# Altium project WalkMod C0.PrjPcb
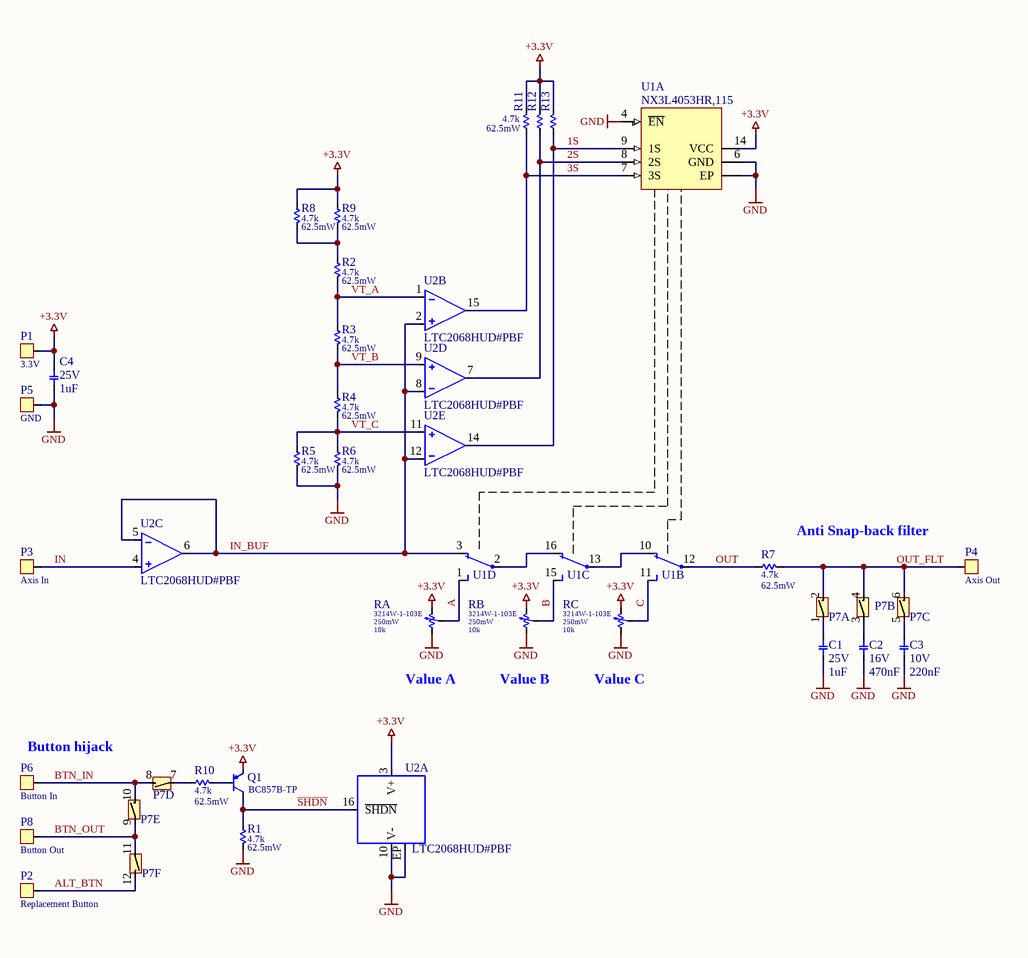
[diagram p0: WalkMod C0.SchDoc]
Author: TheComet; BoardRevision: C0; ProjectTitle: WalkMod
1 sheet, 31 parts. Net scope: global (net labels, ports and power ports of the same name join across sheets).
Board file: WalkMod C0.PcbDoc

## Sheet WalkMod C0.SchDoc: =ProjectTitle
size A4; DrawnBy: TheComet; Engineer: TheComet; Revision: C0; SheetNumber: 1; SheetTotal: 1

### Parts
C1  value 1uF  Value2: 25V  [CX7R0603K]  (hidden comment: CL10B105KA8NFNC)
C2  value 470nF  Value2: 16V  [CX7R0603K]  (hidden comment: CL10B474KO8NFNC)
C3  value 220nF  Value2: 10V  [CX7R0603K]  (hidden comment: CC0603KRX7R6BB224)
C4  value 1uF  Value2: 25V  [CX7R0603K]  (hidden comment: CL10B105KA8NFNC)
P1  Name: 3.3V  [PAD_2X1.5_SQUARE]  (hidden comment: SMD Pad 1 pin)
P2  Name: Replacement Button  [PAD_2X1.5_SQUARE]  (hidden comment: SMD Pad 1 pin)
P3  Name: Axis In  [PAD_2X1.5_SQUARE]  (hidden comment: SMD Pad 1 pin)
P4  Name: Axis Out  [PAD_2X1.5_SQUARE]  (hidden comment: SMD Pad 1 pin)
P5  Name: GND  [PAD_2X1.5_SQUARE]  (hidden comment: SMD Pad 1 pin)
P6  Name: Button In  [PAD_2X1.5_SQUARE]  (hidden comment: SMD Pad 1 pin)
P7  DS05-127-2-06BK-SMT-TR  [CUI-DS05-127-2-06BK-SMT_C]  (value not drawn)  (parts A,B,C,D,E,F of 6)
P8  Name: Button Out  [PAD_2X1.5_SQUARE]  (hidden comment: SMD Pad 1 pin)
Q1  BC857B-TP  [BC8xx_SOT23-3_C]
R1  value 4.7k  Value2: 62.5mW  [RT0402_C]  (hidden comment: RG1005P-472-B-T5)
R2  value 4.7k  Value2: 62.5mW  [RT0402_C]  (hidden comment: RG1005P-472-B-T5)
R3  value 4.7k  Value2: 62.5mW  [RT0402_C]  (hidden comment: RG1005P-472-B-T5)
R4  value 4.7k  Value2: 62.5mW  [RT0402_C]  (hidden comment: RG1005P-472-B-T5)
R5  value 4.7k  Value2: 62.5mW  [RT0402_C]  (hidden comment: RG1005P-472-B-T5)
R6  value 4.7k  Value2: 62.5mW  [RT0402_C]  (hidden comment: RG1005P-472-B-T5)
R7  value 4.7k  Value2: 62.5mW  [RT0402_C]  (hidden comment: RG1005P-472-B-T5)
R8  value 4.7k  Value2: 62.5mW  [RT0402_C]  (hidden comment: RG1005P-472-B-T5)
R9  value 4.7k  Value2: 62.5mW  [RT0402_C]  (hidden comment: RG1005P-472-B-T5)
R10  value 4.7k  Value2: 62.5mW  [RT0402_C]  (hidden comment: RG1005P-472-B-T5)
R11  value 4.7k  Value2: 62.5mW  [RT0402_C]  (hidden comment: RG1005P-472-B-T5)
R12  RG1005P-472-B-T5  [RT0402_C]  (value not drawn)
R13  RG1005P-472-B-T5  [RT0402_C]  (value not drawn)
RA  3214W-1-103E  value 10k  Value2: 250mW  [BOURNS_3214W_C]
RB  3214W-1-103E  value 10k  Value2: 250mW  [BOURNS_3214W_C]
RC  3214W-1-103E  value 10k  Value2: 250mW  [BOURNS_3214W_C]
U1  NX3L4053HR,115  [HXQFN16_SOT1039-2_C]  (parts A,B,C,D of 4)
U2  LTC2068HUD#PBF  [QFN16_0.5_C]  (parts A,B,C,D,E of 5)

### Nets
+3.3V: C4.2 P1.1 Q1.E R8.2 R9.2 R11.1 R12.1 R13.1 RA.3 RB.3 RC.3 U1.14(VCC) U2.3(V+)
GND: C1.1 C2.1 C3.1 C4.1 P5.1 R1.1 R5.1 R6.1 RA.1 RB.1 RC.1 U1.4(~{EN}) U1.6(GND) U1.EP U2.10(V-) U2.EP
1S: R13.2 U1.9(1S) U2.14(OUTD)
2S: R12.2 U1.8(2S) U2.7(OUTC)
3S: R11.2 U1.7(3S) U2.15(OUTA)
A: RA.2 U1.1(3Y1)
ALT_BTN: P2.1 P7.12
B: RB.2 U1.15(2Y1)
BTN_IN: P6.1 P7.8 P7.10
BTN_OUT: P7.9 P7.11 P8.1
C: RC.2 U1.11(1Y1)
IN: P3.1 U2.4(INB+)
IN_BUF: U1.3(3Y0) U2.2(INA+) U2.5(INB-) U2.6(OUTB) U2.8(INC-) U2.12(IND-)
OUT: R7.2 U1.12(1Z)
OUT_FLT: P4.1 P7.2 P7.4 P7.6 R7.1
~{SHDN}: Q1.C R1.2 U2.16(~{SHDN})
VT_A: R2.1 R3.2 U2.1(INA-)
VT_B: R3.1 R4.2 U2.9(INC+)
VT_C: R4.1 R5.2 R6.2 U2.11(IND+)
NetC1_2: C1.2 P7.1
NetC2_2: C2.2 P7.3
NetC3_2: C3.2 P7.5
NetP7_7: P7.7 R10.2
NetQ1_B: Q1.B R10.1
NetR2_2: R2.2 R8.1 R9.1
NetU1_2: U1.2(3Z) U1.16(2Y0)
NetU1_10: U1.10(1Y0) U1.13(2Z)

### Notes on the sheet
- Anti Snap-back filter
- (near RA) Value A
- (near RB) Value B
- (near RC) Value C
- Button hijack

### Library data of the parts
C1 C4 = kyocera-C-X7R-0603: 1 µF ±10% 25V Ceramic Capacitor X7R 0603 (1608 Metric); Size: 0603; Type: CL10B105KA8NFNC
C2 = kyocera-C-X7R-0603: 0.47 µF ±10% 16V Ceramic Capacitor X7R 0603 (1608 Metric); Size: 0603; Type: CL10B474KO8NFNC
C3 = kyocera-C-X7R-0603: 0.22 µF ±10% 10V Ceramic Capacitor X7R 0603 (1608 Metric); Size: 0603; Type: CC0603KRX7R6BB224
P1-P6 P8 = SMD Pad 1 pin: Single SMD Pad
P7 = DS05-127-2-06BK-SMT-TR: Dip Switch SPST 6 Position Surface Mount Slide (Standard) Actuator 25mA 24VDC; Type: DS05-127-2-06BK-SMT-TR
Q1 = BC857B-TP: Bipolar (BJT) Transistor PNP 45 V 100 mA 200MHz 310 mW Surface Mount SOT-23; Type: BC857B-TP
R1-R11 = RT0402DRD0747KL: 4.7 kOhms ±0.1% 0.063W, 1/16W Chip Resistor 0402 (1005 Metric) Anti-Sulfur, Automotive AEC-Q200 Thin Film; Type: RG1005P-472-B-T5
R12 R13 = RT0402DRD0747KL: 4.7 kOhms ±0.1% 0.063W, 1/16W Chip Resistor 0402 (1005 Metric) Anti-Sulfur, Automotive AEC-Q200 Thin Film; Value: 4.7k; Value2: 62.5mW; Type: RG1005P-472-B-T5
RA RB RC = 3214W-1-103E: 10 kOhms 0.25W, 1/4W J Lead Surface Mount Trimmer Potentiometer Cermet 5.0 Turn Top Adjustment; Type: 3214W-1-103E
U1 = NX3L4053: 3 Circuit IC Switch 2:1 800mOhm 16-HXQFN (3x3); Manufacturer Part Number 1: NXP USA Inc.; Type: NX3L4053HR,115; Manufacturer 1: NX3L4053HR,115
U2 = LTC2068HUD#PBF: Zero-Drift Amplifier 4 Circuit Rail-to-Rail 16-QFN (3x3); Manufacturer 1: Analog Devices Inc.; Type: LTC2068HUD#PBF; Manufacturer Part Number 1: LTC2068HUD#PBF